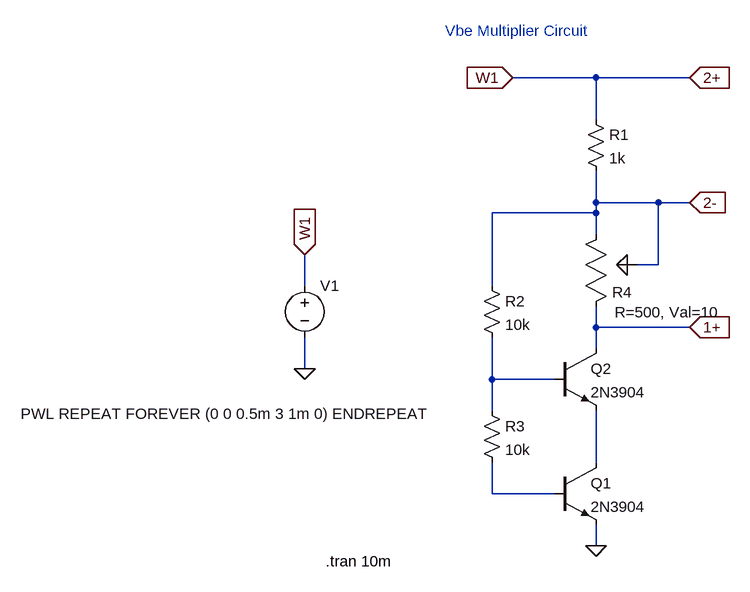
[diagram p0: schematic vbe_circuit2_ltspice.asc]
vbe_circuit2_ltspice.asc, the LTspice schematic file:
Version 4
SHEET 1 880 680
WIRE 208 -496 80 -496
WIRE 352 -496 208 -496
WIRE 208 -432 208 -496
WIRE 208 -304 208 -352
WIRE 304 -304 208 -304
WIRE 352 -304 304 -304
WIRE 208 -288 208 -304
WIRE 208 -288 48 -288
WIRE 208 -256 208 -288
WIRE 304 -208 304 -304
WIRE 304 -208 272 -208
WIRE -240 -176 -240 -224
WIRE 48 -176 48 -288
WIRE 208 -112 208 -144
WIRE 352 -112 208 -112
WIRE 208 -80 208 -112
WIRE -240 -48 -240 -96
WIRE 48 -32 48 -96
WIRE 144 -32 48 -32
WIRE 48 16 48 -32
WIRE 208 96 208 16
WIRE 48 144 48 96
WIRE 144 144 48 144
WIRE 208 224 208 192
FLAG 80 -496 W1
IOPIN 80 -496 In
FLAG -240 -48 0
FLAG -240 -224 W1
IOPIN -240 -224 In
FLAG 208 224 0
FLAG 352 -496 2+
IOPIN 352 -496 In
FLAG 352 -304 2-
IOPIN 352 -304 In
FLAG 352 -112 1+
IOPIN 352 -112 In
SYMBOL npn 144 96 R0
SYMATTR InstName Q1
SYMATTR Value 2N3904
SYMBOL res 192 -448 R0
SYMATTR InstName R1
SYMATTR Value 1k
SYMBOL voltage -240 -192 R0
WINDOW 3 -437 213 Left 2
WINDOW 123 0 0 Left 0
WINDOW 39 0 0 Left 0
SYMATTR Value PWL REPEAT FOREVER (0 0 0.5m 3 1m 0) ENDREPEAT
SYMATTR InstName V1
SYMBOL npn 144 -80 R0
SYMATTR InstName Q2
SYMATTR Value 2N3904
SYMBOL res 32 -192 R0
SYMATTR InstName R2
SYMATTR Value 10k
SYMBOL res 32 0 R0
SYMATTR InstName R3
SYMATTR Value 10k
SYMBOL potentiometer 224 -240 M0
WINDOW 0 -40 74 Left 2
WINDOW 39 -174 105 Left 2
SYMATTR InstName R4
SYMATTR SpiceLine R=500, Val=10
TEXT -208 248 Left 2 !.tran 10m
TEXT -24 -568 Left 2 ;Vbe Multiplier Circuit

The netlist it stands for:
* vbe_circuit2_ltspice.asc
Q1 N002 N003 0 0 2N3904
R1 2+ 2- 1k
V1 2+ 0 PWL REPEAT FOREVER (0 0 0.5m 3 1m 0) ENDREPEAT
Q2 1+ N001 N002 0 2N3904
R2 2- N001 10k
R3 N001 N003 10k
XR4 2- 2- 1+ potentiometer R=500, Val=10  ; pins 1 2 3
.model NPN NPN
.model PNP PNP
.lib standard.bjt
.tran 10m
* Vbe Multiplier Circuit
.backanno
.end